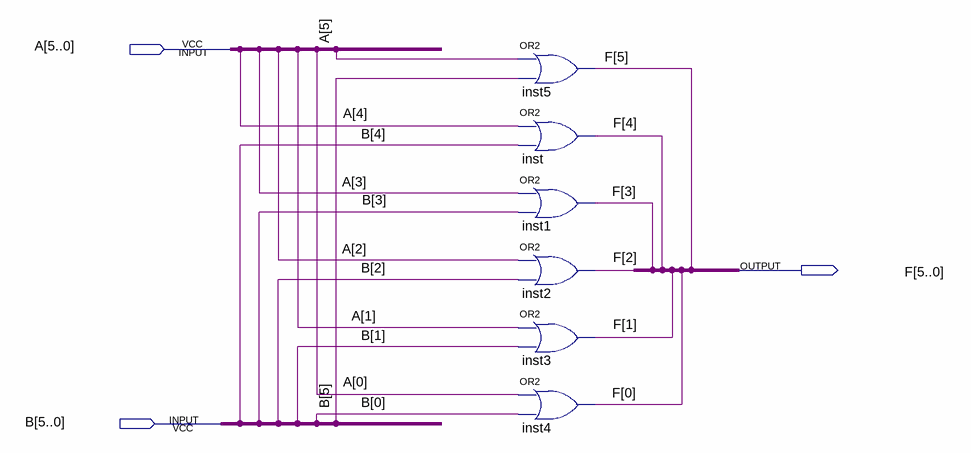
[diagram p0: schematic sheet]
// Quartus schematic For5bits.bdf as structural Verilog: 6 symbols, 3 pins
module For5bits (
  input  [5:0] A,
  input  [5:0] B,
  output [5:0] F
);

  or inst5 (F[5], A[5], B[5]);
  or inst (F[4], A[4], B[4]);
  or inst1 (F[3], A[3], B[3]);
  or inst2 (F[2], A[2], B[2]);
  or inst3 (F[1], A[1], B[1]);
  or inst4 (F[0], A[0], B[0]);
endmodule
